# Altium schematic sheet 5 External interface.SchDoc
size 594 x 420 mm; SheetNumber: 6; SheetTotal: 9
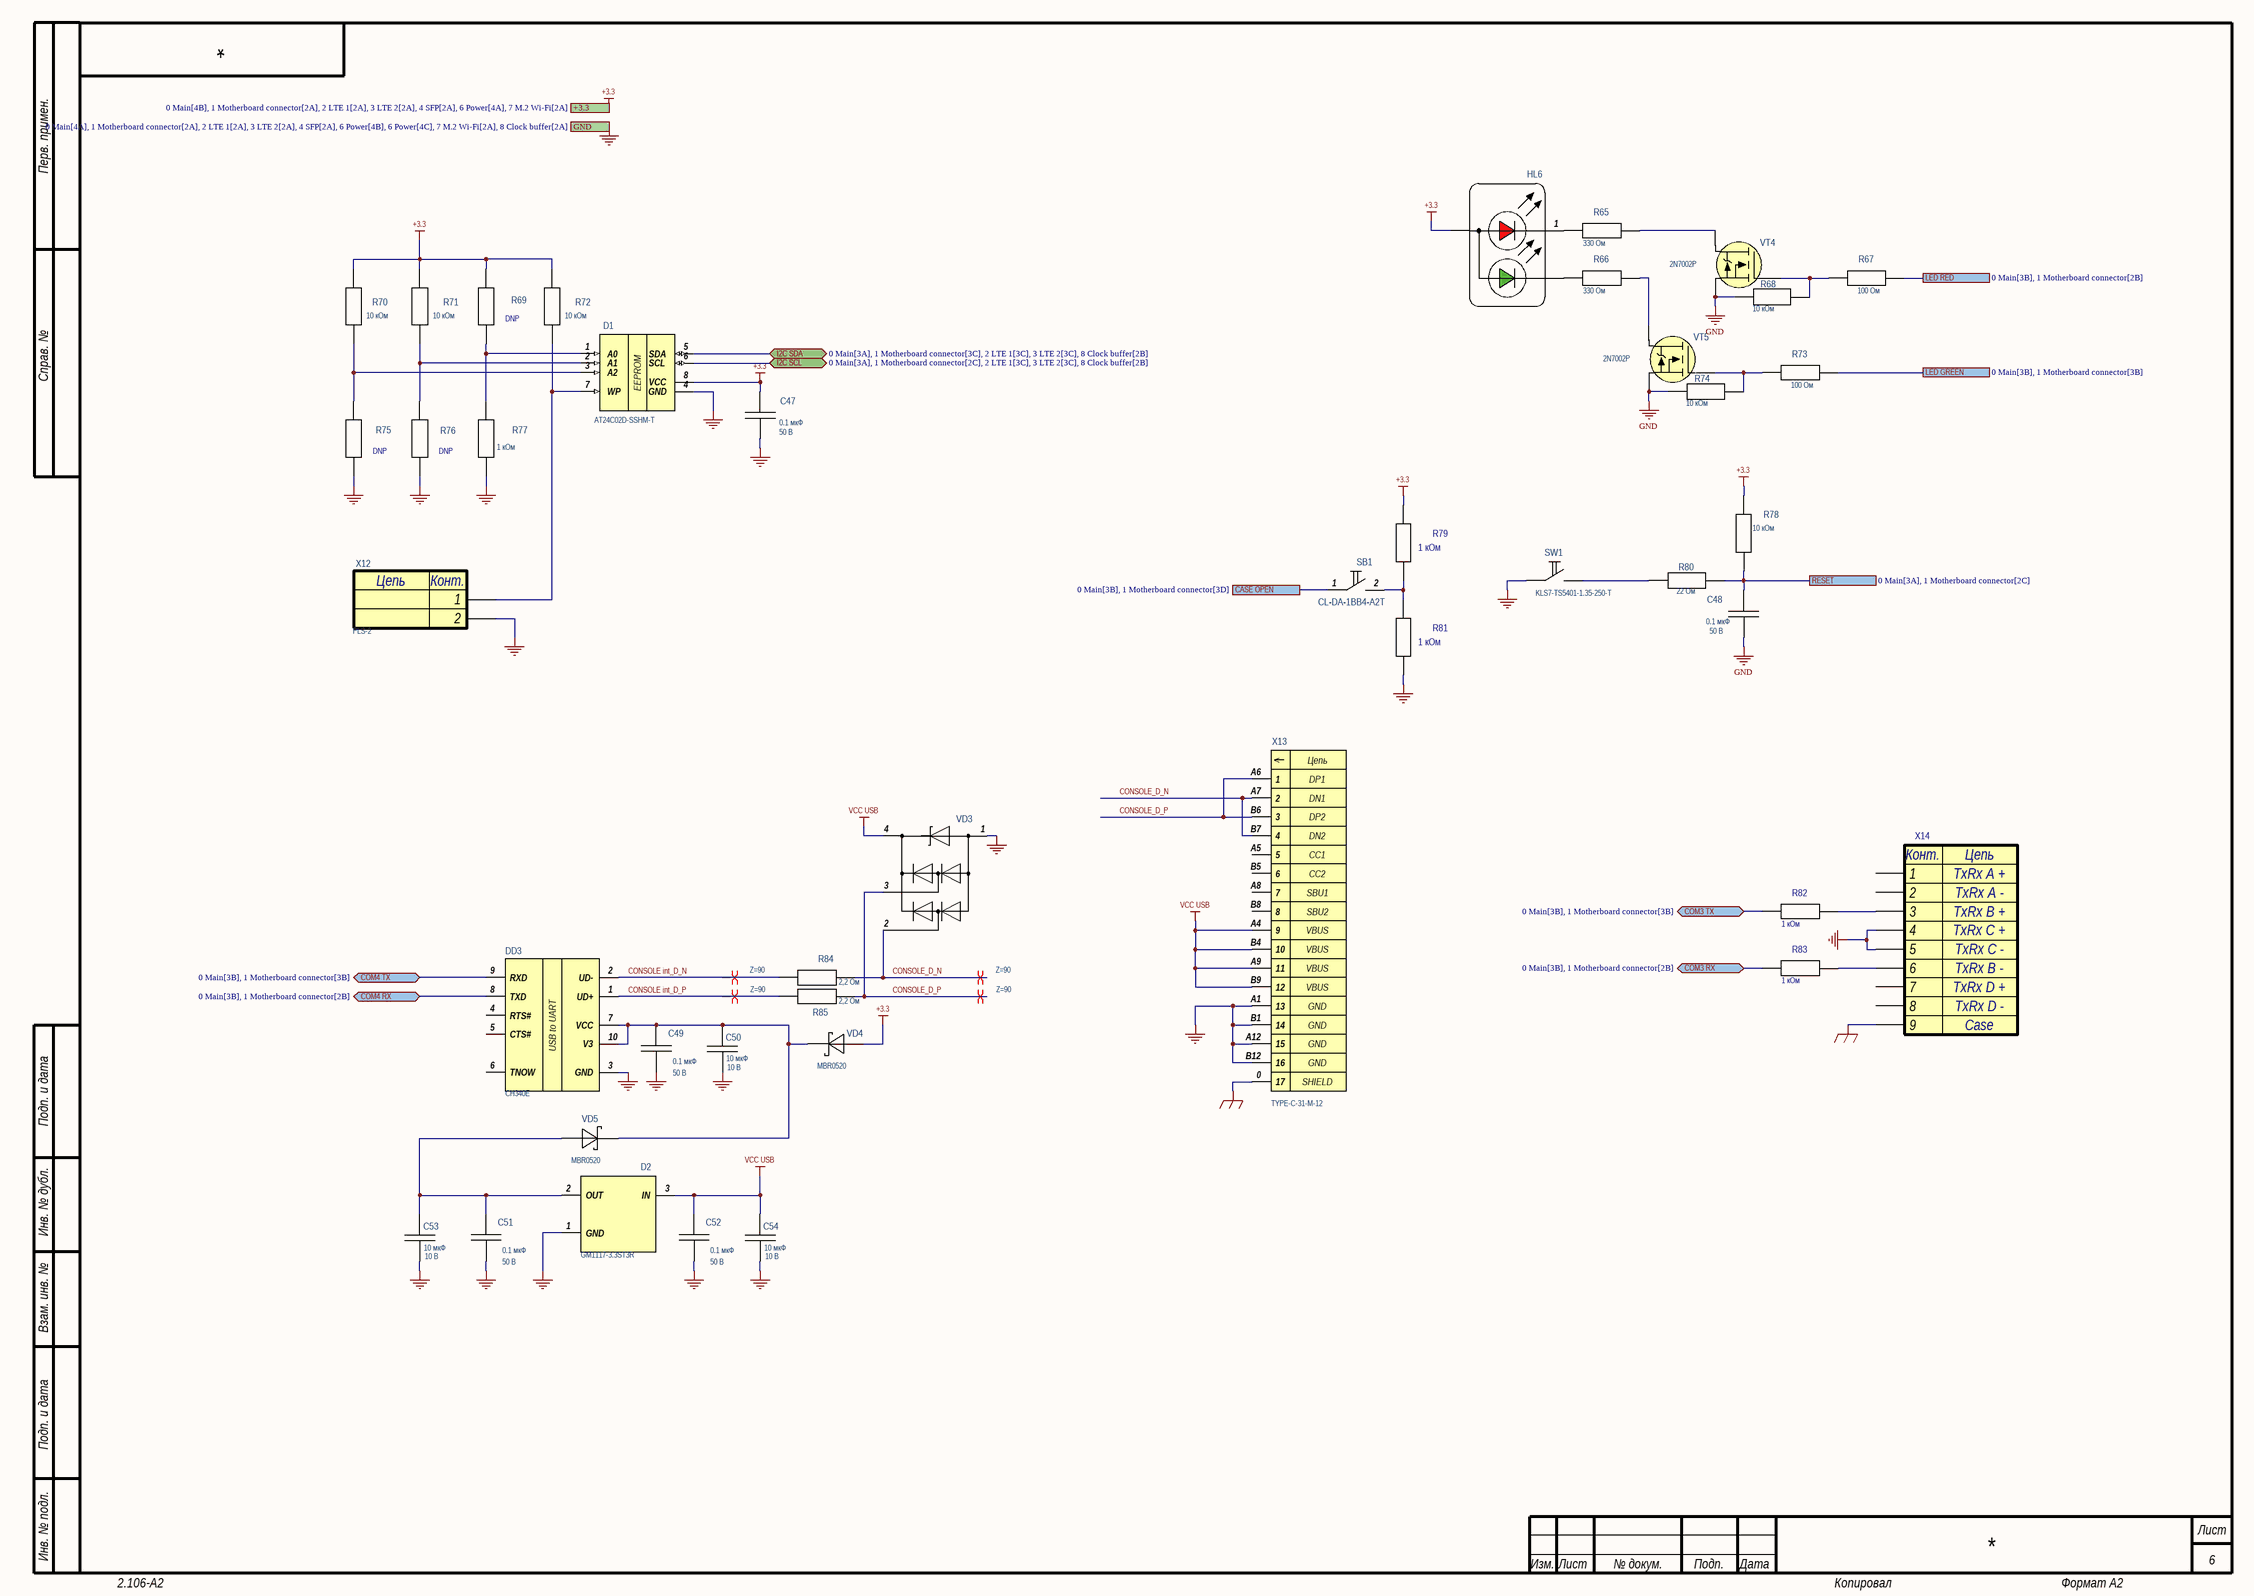
[diagram p0: 5 External interface.SchDoc]

## Parts
C47  value 0.1 мкФ  Напряжение: 50 В  [CAP_0402]
C48  value 0.1 мкФ  Напряжение: 50 В  [CAP_0402]
C49  value 0.1 мкФ  Напряжение: 50 В  [CAP_0402]
C50  value 10 мкФ  Напряжение: 10 В  [CAP_0603]
C51  value 0.1 мкФ  Напряжение: 50 В  [CAP_0402]
C52  value 0.1 мкФ  Напряжение: 50 В  [CAP_0402]
C53  value 10 мкФ  Напряжение: 10 В  [CAP_0603]
C54  value 10 мкФ  Напряжение: 10 В  [CAP_0603]
D1  AT24C02D-SSHM-T  [SOIC-8]
D2  GM1117-3.3ST3R  [SOT-223]
DD3  CH340E  [MSOP-10]
HL6  LTST-S326KGJRKT  [LTST-S326KGJRKT]  (value not drawn)
R65  value 330 Ом  [RES_0402]  (hidden comment: STD_RES)
R66  value 330 Ом  [RES_0402]  (hidden comment: STD_RES)
R67  value 100 Ом  [RES_0402]  (hidden comment: STD_RES)
R68  value 10 кОм  [RES_0402]  (hidden comment: STD_RES)
R69  STD_RES  [RES_0402]  (value not drawn)
R70  value 10 кОм  [RES_0402]  (hidden comment: STD_RES)
R71  value 10 кОм  [RES_0402]  (hidden comment: STD_RES)
R72  value 10 кОм  [RES_0402]  (hidden comment: STD_RES)
R73  value 100 Ом  [RES_0402]  (hidden comment: STD_RES)
R74  value 10 кОм  [RES_0402]  (hidden comment: STD_RES)
R75  STD_RES  [RES_0402]  (value not drawn)
R76  STD_RES  [RES_0402]  (value not drawn)
R77  value 1 кОм  [RES_0402]  (hidden comment: STD_RES)
R78  value 10 кОм  [RES_0402]  (hidden comment: STD_RES)
R79  value 1 кОм  [RES_0402]  (hidden comment: STD_RES)
R80  value 22 Ом  [RES_0402]  (hidden comment: STD_RES)
R81  value 1 кОм  [RES_0402]  (hidden comment: STD_RES)
R82  value 1 кОм  [RES_0402]  (hidden comment: STD_RES)
R83  value 1 кОм  [RES_0402]  (hidden comment: STD_RES)
R84  value 2,2 Ом  [RES_0402]  (hidden comment: STD_RES)
R85  value 2,2 Ом  [RES_0402]  (hidden comment: STD_RES)
SB1  CL-DA-1BB4-A2T  [CL-DA-1BB4-A2T]
SW1  KLS7-TS5401-1.35-250-T  [KLS7-TS5401-1.35-250-T]
VD3  WE05R  [SOT143]  (value not drawn)
VD4  PartNumber: MBR0520  [SOD123]  (hidden comment: STD_DIODE_SCHOTTKY)
VD5  PartNumber: MBR0520  [SOD123]  (hidden comment: STD_DIODE_SCHOTTKY)
VT4  2N7002P  [SOT-23-3]
VT5  2N7002P  [SOT-23-3]
X12  STD_CON2  [PLS-2]  (value not drawn)
X13  TYPE-C-31-M-12  [USB_TYPE_C_16_PIN_TYPE-C-31-M-12]
X14  DS1126-S80BP  [DS1126-S80BP]  (value not drawn)

## Ports
+3.3 (see 0 Main[4B], 1 Motherboard connector[2A], 2 LTE 1[2A], 3 LTE 2[2A], 4 SFP[2A], 6 Power[4A], 7 M.2 Wi-Fi[2A]), CASE OPEN (see 0 Main[3B], 1 Motherboard connector[3D]), COM3 RX (bidir, see 0 Main[3B], 1 Motherboard connector[2B]), COM3 TX (bidir, see 0 Main[3B], 1 Motherboard connector[3B]), COM4 RX (bidir, see 0 Main[3B], 1 Motherboard connector[2B]), COM4 TX (bidir, see 0 Main[3B], 1 Motherboard connector[3B]), GND (see 0 Main[4A], 1 Motherboard connector[2A], 2 LTE 1[2A], 3 LTE 2[2A], 4 SFP[2A], 6 Power[4B], 6 Power[4C], 7 M.2 Wi-Fi[2A], 8 Clock buffer[2A]), I2C SCL (bidir, see 0 Main[3A], 1 Motherboard connector[2C], 2 LTE 1[3C], 3 LTE 2[3C], 8 Clock buffer[2B]), I2C SDA (bidir, see 0 Main[3A], 1 Motherboard connector[3C], 2 LTE 1[3C], 3 LTE 2[3C], 8 Clock buffer[2B]), LED GREEN (see 0 Main[3B], 1 Motherboard connector[3B]), LED RED (see 0 Main[3B], 1 Motherboard connector[2B]), RESET (see 0 Main[3A], 1 Motherboard connector[2C])

## Nets
+3.3: C47.1 D1.8(VCC) HL6.3(A) R69.2 R70.2 R71.2 R72.2 R78.2 R79.1 VD4.2 ; port +3.3
GND: C47.2 C48.2 C49.2 C50.2 C51.2 C52.2 C53.2 C54.2 D1.4(GND) D2.1(GND) DD3.3(GND) R68.1 R74.1 R75.1 R76.1 R77.1 R81.2 SW1.1 VD3.1 VT4.2(S) VT5.2(S) X12.2 X13.A1(13) X13.A12(15) X13.B1(14) X13.B12(16) X14.4 X14.5 ; port GND
GNDG: X13.0(17) X14.9
VCC USB: C52.1 C54.1 D2.3(IN) VD3.4 X13.A4(9) X13.A9(11) X13.B4(10) X13.B9(12)
CASE OPEN: SB1.1 ; port CASE OPEN
COM3 RX: R83.1 ; port COM3 RX
COM3 TX: R82.1 ; port COM3 TX
COM4 RX: DD3.8(TXD) ; port COM4 RX
COM4 TX: DD3.9(RXD) ; port COM4 TX
CONSOLE int_D_N: DD3.2(UD-) R84.1
CONSOLE int_D_P: DD3.1(UD+) R85.1
CONSOLE_D_N: R84.2 VD3.2 X13.A7(2) X13.B7(4)
CONSOLE_D_P: R85.2 VD3.3 X13.A6(1) X13.B6(3)
I2C SCL: D1.6(SCL) ; port I2C SCL
I2C SDA: D1.5(SDA) ; port I2C SDA
LED GREEN: R73.2 ; port LED GREEN
LED RED: R67.2 ; port LED RED
RESET: C48.1 R78.1 R80.1 ; port RESET
NetC49_1: C49.1 C50.1 DD3.7(VCC) DD3.10(V3) VD4.1 VD5.1
NetC51_1: C51.1 C53.1 D2.2(OUT) VD5.2
NetD1_1: D1.1(A0) R69.1 R77.2
NetD1_2: D1.2(A1) R71.1 R76.2
NetD1_3: D1.3(A2) R70.1 R75.2
NetD1_7: D1.7(WP) R72.1 X12.1
NetHL6_1: HL6.1(K) R65.1
NetHL6_2: HL6.2(K) R66.1
NetR65_2: R65.2 VT4.3(D)
NetR66_2: R66.2 VT5.3(D)
NetR67_1: R67.1 R68.2 VT4.1(G)
NetR73_1: R73.1 R74.2 VT5.1(G)
NetR79_2: R79.2 R81.1 SB1.2
NetR80_2: R80.2 SW1.2
NetR82_2: R82.2 X14.3
NetR83_2: R83.2 X14.6

Not connected (* = marked no-connect by the designer): DD3 4(RTS#) 5(CTS#) 6(TNOW); X13 A5(5) A8(7) B5(6) B8(8); X14 1 2 7 8

## Layout directives
differential pair; differential pair class Z=90: CONSOLE int_D_N, CONSOLE int_D_P, CONSOLE_D_N, CONSOLE_D_P

## Notes on the sheet
- (near R69) DNP
- (near R75) DNP
- (near R76) DNP
- Перв. примен.
- Справ. №
- Подп. и дата
- Инв. № дубл.
- Взам. инв. №
- Инв. № подл.
- Изм.
- Лист
- № докум.
- Подп.
- Дата
- 2.106-A2
- Копировал
- Формат А2
- (in symbol AT24C02D-SSHM-T) EEPROM
- (in symbol DS1126-S80BP) Конт.; Цепь; TxRx A +; TxRx A -; TxRx B +; TxRx C +; TxRx C -; TxRx B -; TxRx D +; TxRx D -; Case
- (in symbol PLS-2) Цепь; Конт.
- (in symbol TYPE-C-31-M-12) Цепь; DP1; DN1; DP2; DN2; CC1; CC2; SBU1; SBU2; VBUS; GND; SHIELD

## Library data of the parts
C47-C49 C51 C52 = CC0402KRX7R9BB104: Конденсатор CHIP-0402 0.1 мкФ 50 В 10% X7R; Manufacturer: YAGEO; ID: 357; Температура: -55...+85°C; Autor: Admin; PartNumber: CC0402KRX7R9BB104; Type: CHIP-0402; Tolerance: 10%; Диэлектрик: X7R; Data: 10-04-2024
C50 C53 C54 = GRM188Z71A106KA73D: Конденсатор CHIP-0603 10 мкФ 10 В 10% X7R; Manufacturer: MURATA; ID: 394; Температура: -55...+155°C; Autor: Admin; PartNumber: GRM188Z71A106KA73D; Type: CHIP-0603; Tolerance: 10%; Диэлектрик: X7R; Data: 08-26-2025
D1 = AT24C02D-SSHM-T: Микросхема Atmel  EEPROM 2K I2C 1MHZ; ID: 751; Type: Memory; Voltage: 1.7-3.6В; Current: 3 мА; Температура: -40...+85°C; Autor: Admin; PartNumber: AT24C02D-SSHM-T; Value: EEPROM 2K I2C 1MHZ; Manufacturer: Atmel; Data: 05-31-2024
D2 = GM1117-3.3ST3R: Микросхема Gamma Electronica  1.0 A Low-Dropout LDO; ID: 750; Type: LDOs; Voltage: 3.3В; Current: 1 А; Температура: 0...+125°C; Autor: Admin; PartNumber: GM1117-3.3ST3R; Value: 1.0 A Low-Dropout LDO; Manufacturer: Gamma Electronica; Data: 05-23-2024
DD3 = CH340E: Микросхема MPJA USB to UART; ID: 734; Voltage: 5В; Current: 100 мА; Температура: -40...+85°C; Autor: Admin; Component Type: Микросхема; PartNumber: CH340E; Type: Interfaces; Value: USB to UART; Manufacturer: MPJA; Data: 11-13-2023
HL6 = LTST-S326KGJRKT: Диод LITEON 2 В 30 мА; ID: 122; Type: LED; U_direct: 2 В; U_reverse: 5 В; Current: 30 мА; Температура: -40...+85°C; Autor: Admin; PartNumber: LTST-S326KGJRKT; Manufacturer: LITEON; Data: 01-11-2021
R65 R66 = RC0402FR-07330RL: Резистор CHIP-0402 330 Ом 1%; Manufacturer: YAGEO; ID: 319; ТКС: 100 ppm/K; Температура: -55...+155°C; Autor: Цислав А.Н.; PartNumber: RC0402FR-07330RL; Type: CHIP-0402; Tolerance: 1%; Data: 02-03-2014
R67 R73 = RC0402FR-07100RL: Резистор CHIP-0402 100 Ом 1%; Manufacturer: YAGEO; ID: 298; ТКС: 100 ppm/K; Температура: -55...+155°C; Autor: Цислав А.Н.; PartNumber: RC0402FR-07100RL; Type: CHIP-0402; Tolerance: 1%; Data: 02-03-2014
R68 R70-R72 R74 R78 = RC0402FR-0710KL: Резистор CHIP-0402 10 кОм 1%; Manufacturer: YAGEO; ID: 412; ТКС: 100 ppm/K; Температура: -55...+155°C; Autor: Цислав А.Н.; PartNumber: RC0402FR-0710KL; Type: CHIP-0402; Tolerance: 1%; Data: 02-03-2014
R69 R75 R76 = RC0402FR-0710KL: Резистор CHIP-0402 10 кОм 1%; Manufacturer: YAGEO; ID: 412; Value: 10 кОм; ТКС: 100 ppm/K; Температура: -55...+155°C; Autor: Цислав А.Н.; PartNumber: RC0402FR-0710KL; Type: CHIP-0402; Tolerance: 1%; Data: 02-03-2014
R77 R79 R81 = RC0402FR-071KL: Резистор CHIP-0402 1 кОм 1%; Manufacturer: YAGEO; ID: 337; ТКС: 100 ppm/K; Температура: -55...+155°C; Autor: Цислав А.Н.; PartNumber: RC0402FR-071KL; Type: CHIP-0402; Tolerance: 1%; Data: 02-03-2014
R80 = RC0402FR-0722RL: Резистор CHIP-0402 22 Ом 1%; Manufacturer: YAGEO; ID: 272; ТКС: 100 ppm/K; Температура: -55...+155°C; Autor: Цислав А.Н.; PartNumber: RC0402FR-0722RL; Type: CHIP-0402; Tolerance: 1%; Data: 02-03-2014
R82 R83 = RC0402JR-071KL: Резистор CHIP-0402 1 кОм 5%; Manufacturer: YAGEO; ID: 338; ТКС: 100 ppm/K; Температура: -55...+155°C; Autor: Цислав А.Н.; PartNumber: RC0402JR-071KL; Type: CHIP-0402; Tolerance: 5%; Data: 02-03-2014
R84 R85 = RC0402FR-072R2L: Резистор CHIP-0402 2,2 Ом 1%; Manufacturer: YAGEO; ID: 733; ТКС: 200 ppm/K; Температура: -55...+155°C; Autor: Admin; PartNumber: RC0402FR-072R2L; Type: CHIP-0402; Tolerance: 1%; Data: 11-08-2023
SB1 = CL-DA-1BB4-A2T: Copal Electronics  DETECT SWITCH right angle NC; ID: 98; Voltage: 12 B; Current: 100 мА; Температура: -40...+85°C; Autor: Admin; PartNumber: CL-DA-1BB4-A2T; Type: BUTTON; Value: DETECT SWITCH right angle NC; Manufacturer: Copal Electronics; Data: 05-15-2018
SW1 = KLS7-TS5401-1.35-250-T: KLS Угловая кнопка тактовая SMD; ID: 155; Voltage: 12V; Current: 50 мА; Температура: -30...+70°C; Autor: Admin; PartNumber: KLS7-TS5401-1.35-250-T; Type: BUTTON; Value: Угловая кнопка тактовая SMD; Manufacturer: KLS; Data: 04-09-2024
VD3 = WE05R: Диод WAYON 5 В 5 А; ID: 126; Type: Diode TVS; U_direct: 5 В; Current: 5 А; Температура: -55...+125°C; Autor: Admin; PartNumber: WE05R; U_reverse: 5 В; Manufacturer: WAYON; Data: 12-08-2023
VD4 VD5 = MBR0520: Диод IR 500 мВ 500 мА; ID: 33; Type: Diode Schottky; U_direct: 500 мВ; U_reverse: 20 В; Current: 500 мА; Температура: -40...+85°C; Autor: Admin; Manufacturer: IR; Data: 10-22-2015
VT4 VT5 = 2N7002P: Микросхема NXP  N-channel Trench MOSFET; ID: 321; Type: MOSFET N-Channel; Voltage: 60В; Current: 300 мА; Температура: -40...+85°C; Autor: Admin; PartNumber: 2N7002P; Value: N-channel Trench MOSFET; Manufacturer: NXP; Data: 05-24-2016
X12 = PLS-2: Разъем NoName PLS; ID: 2; Pitch: 2.54 мм; Current: 2 А; Autor: Admin; PartNumber: PLS-2; Type: PLS; Contact: 2; Mounting: Сквозной; Manufacturer: NoName; Data: 09-04-2013
X13 = TYPE-C-31-M-12: Разъем Hroparts Electronics USB; ID: 375; Contact: 14; Pitch: 0.5 мм; Current: 1 А; Autor: Admin; PartNumber: TYPE-C-31-M-12; Type: USB; Mounting: Поверхностный; Manufacturer: Hroparts Electronics; Data: 05-13-2024
X14 = DS1126-S80BP: Разъем Connfly LAN; ID: 364; Contact: 8; Pitch: 1.27 мм; Current: 1 А; Autor: Admin; PartNumber: DS1126-S80BP; Type: LAN; Mounting: Сквозной; Manufacturer: Connfly; Data: 04-04-2024